# EAGLE design phoneline_fixer (EAGLE 9.6.0)
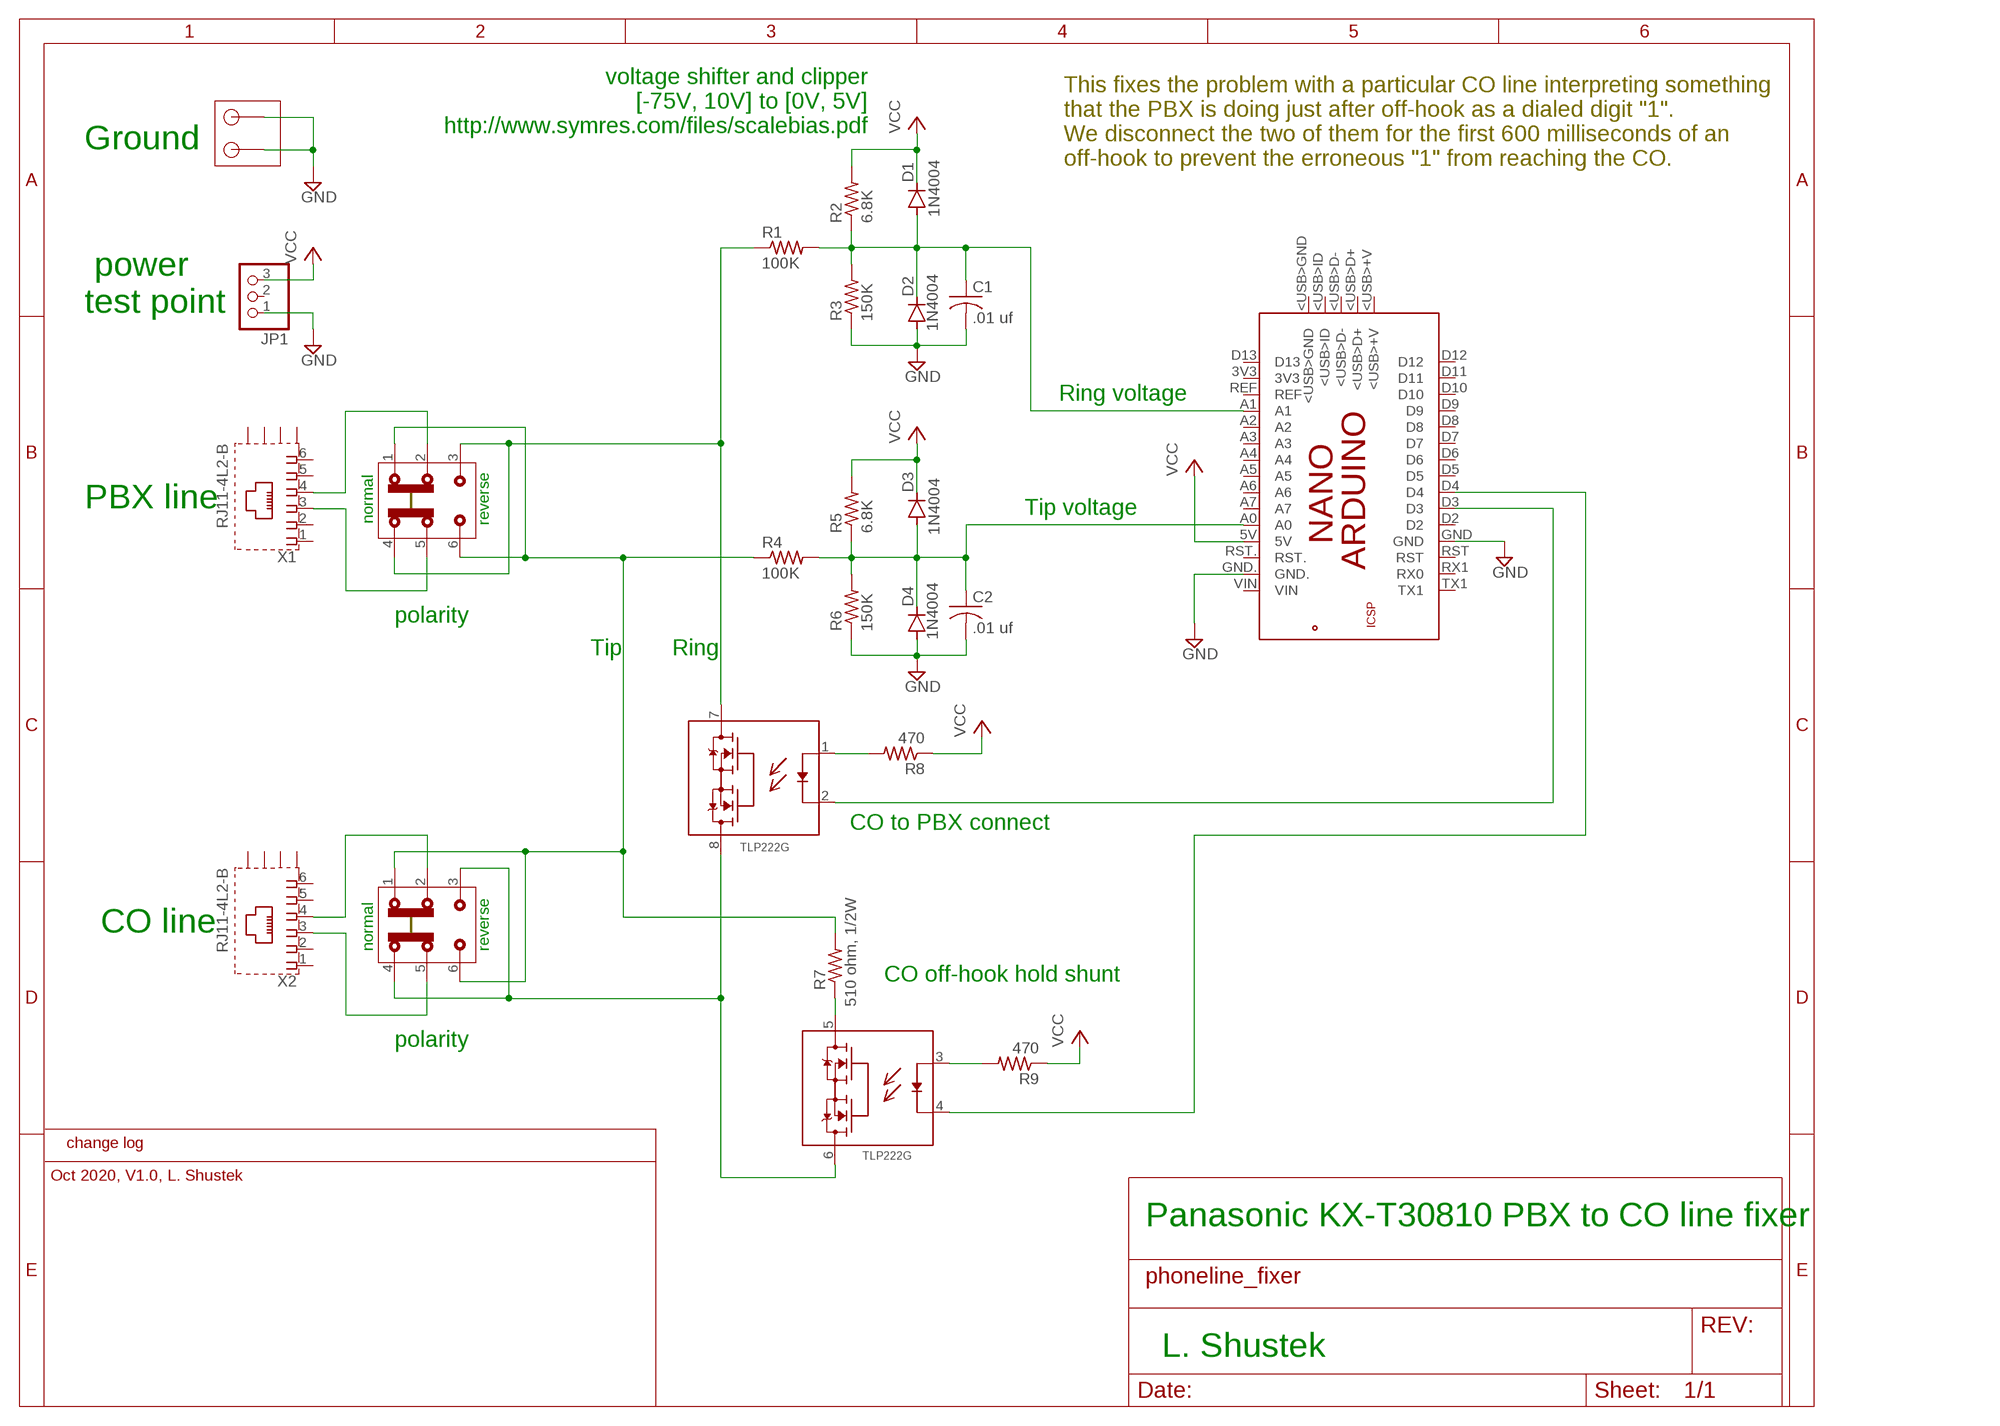
[diagram p0: schematic, sheet 1]

## Parts
C1  .01 uf  C-US050-025X075  [C050-025X075]
C2  .01 uf  C-US050-025X075  [C050-025X075]
D1  1N4004  [DO41-10]
D2  1N4004  [DO41-10]
D3  1N4004  [DO41-10]
D4  1N4004  [DO41-10]
JP1  PINHD-1X3  [1X03]
PCB1  ARDUINO_NANO  [ARDUINO_NANO]
R1  100K  R-US_0207/12  [0207/12]
R2  6.8K  R-US_0207/12  [0207/12]
R3  150K  R-US_0207/12  [0207/12]
R4  100K  R-US_0207/12  [0207/12]
R5  6.8K  R-US_0207/12  [0207/12]
R6  150K  R-US_0207/12  [0207/12]
R7  510 ohm, 1/2W  R-US_0414/15  [0414/15]
R8  470  R-US_0207/12  [0207/12]
R9  470  R-US_0207/12  [0207/12]
U$1  TLP222G  PHOTORELAY  [DIL08]
U$2  CONNECTOR-2PINTHIN  [CONNECTOR-2PIN-5MM_THIN]
U$3  SWITCH_SLIDE_DPDT  [SWITCH_SLIDE_DPDT]
U$4  SWITCH_SLIDE_DPDT  [SWITCH_SLIDE_DPDT]
X1  RJ11-4L2-B  [RJ11-SHIELD2]
X2  RJ11-4L2-B  [RJ11-SHIELD2]

## Nets
GND: C1.2 C2.2 D2.A D4.A JP1.1 PCB1.GND PCB1.GND. R3.1 R6.1 U$2.P$1 U$2.P$2
N$1: C1.1 D1.A D2.C PCB1.A1 R1.2 R2.1 R3.2
N$2: C2.1 D3.A D4.C PCB1.A0 R4.2 R5.1 R6.2
N$4: R7.1 U$1.5(G$1B:D2)
N$6: R8.2 U$1.1(G$1A:A)
N$8: R9.2 U$1.3(G$1B:A)
N$9: U$4.5 X2.3
N$10: U$4.2 X2.4
N$11: PCB1.D3 U$1.2(G$1A:C)
N$12: PCB1.D4 U$1.4(G$1B:C)
N$13: R4.1 R7.2 U$3.1 U$3.6 U$4.1 U$4.6
N$14: U$1.6(G$1B:D1) U$1.8(G$1A:D1) U$4.3 U$4.4
N$15: U$3.5 X1.3
N$16: U$3.2 X1.4
N$18: R1.1 U$1.7(G$1A:D2) U$3.3 U$3.4
VCC: D1.C D3.C JP1.3 PCB1.5V R2.2 R5.2 R8.1 R9.1
Unconnected: JP1.2 PCB1.3V3 PCB1.5V. PCB1.<USB>+V PCB1.<USB>D+ PCB1.<USB>D- PCB1.<USB>GND PCB1.<USB>ID PCB1.A2 PCB1.A3 PCB1.A4 PCB1.A5 PCB1.A6 PCB1.A7 PCB1.D2 PCB1.D5 PCB1.D6 PCB1.D7 PCB1.D8 PCB1.D9 PCB1.D10 PCB1.D11 PCB1.D12 PCB1.D13 PCB1.GND_ PCB1.MISO PCB1.MOSI PCB1.REF PCB1.RESET.. PCB1.RST PCB1.RST. PCB1.RX1(RX0) PCB1.SCK PCB1.TX1 PCB1.VIN X1.1 X1.2 X1.5 X1.6 X1.S1(S) X1.S2(S) X1.S3(S) X1.S4(S) X2.1 X2.2 X2.5 X2.6 X2.S1(S) X2.S2(S) X2.S3(S) X2.S4(S)

## Notes on the sheet
- voltage shifter and clipper
   [-75V, 10V] to [0V, 5V]
  http://www.symres.com/files/scalebias.pdf
- Ground
- This fixes the problem with a particular CO line interpreting something 
  that the PBX is doing just after off-hook as a dialed digit "1". 
  We disconnect the two of them for the first 600 milliseconds of an
  off-hook to prevent the erroneous "1" from reaching the CO.
- power
  test point
- Ring voltage
- PBX line | Tip voltage
- normal | reverse
- polarity
- Tip | Ring
- CO to PBX connect
- CO line
- normal | reverse
- CO off-hook hold shunt
- polarity
- change log
- Oct 2020, V1.0, L. Shustek
- Panasonic KX-T30810 PBX to CO line fixer
- L. Shustek

## Library data of the parts
C1 C2 = resistor:C-US: CAPACITOR, American symbol
D1-D4 = Len:1N4004: DIODE general purpose rectifier, 1 A
JP1 = pinhead:PINHD-1X3: PIN HEADER
PCB1 = Ardunio_E14:ARDUINO_NANO: Device for representing an Arduino Nano board with a footprint in an EAGLE design. Created by Dave Young for Element14. More EAGLE documentation at: http://www.element14.com/community/community/knode/cadsoft_eagle
R1-R9 = resistor:R-US_: RESISTOR, American symbol
U$1 = Len:PHOTORELAY
U$2 = Len:CONNECTOR-2PIN
U$3 U$4 = Len:SWITCH_SLIDE_DPDT: DPDT slide switch
X1 X2 = con-tycoelectronics:RJ11*2: RJ11 (Style 1 Shield / Style 2 Shield) Source: www.tycoelectronics.com .. ENG_DS_1654001_1099_RJ_L_0507.pdf; MF: TYCO ELECTRONICS; MPN: RJ11-4L2-B; OC_FARNELL: unknown; OC_NEWARK: 50F8856

## Net classes
0 default: width 0.635 mm, clearance 0.381 mm

## Board
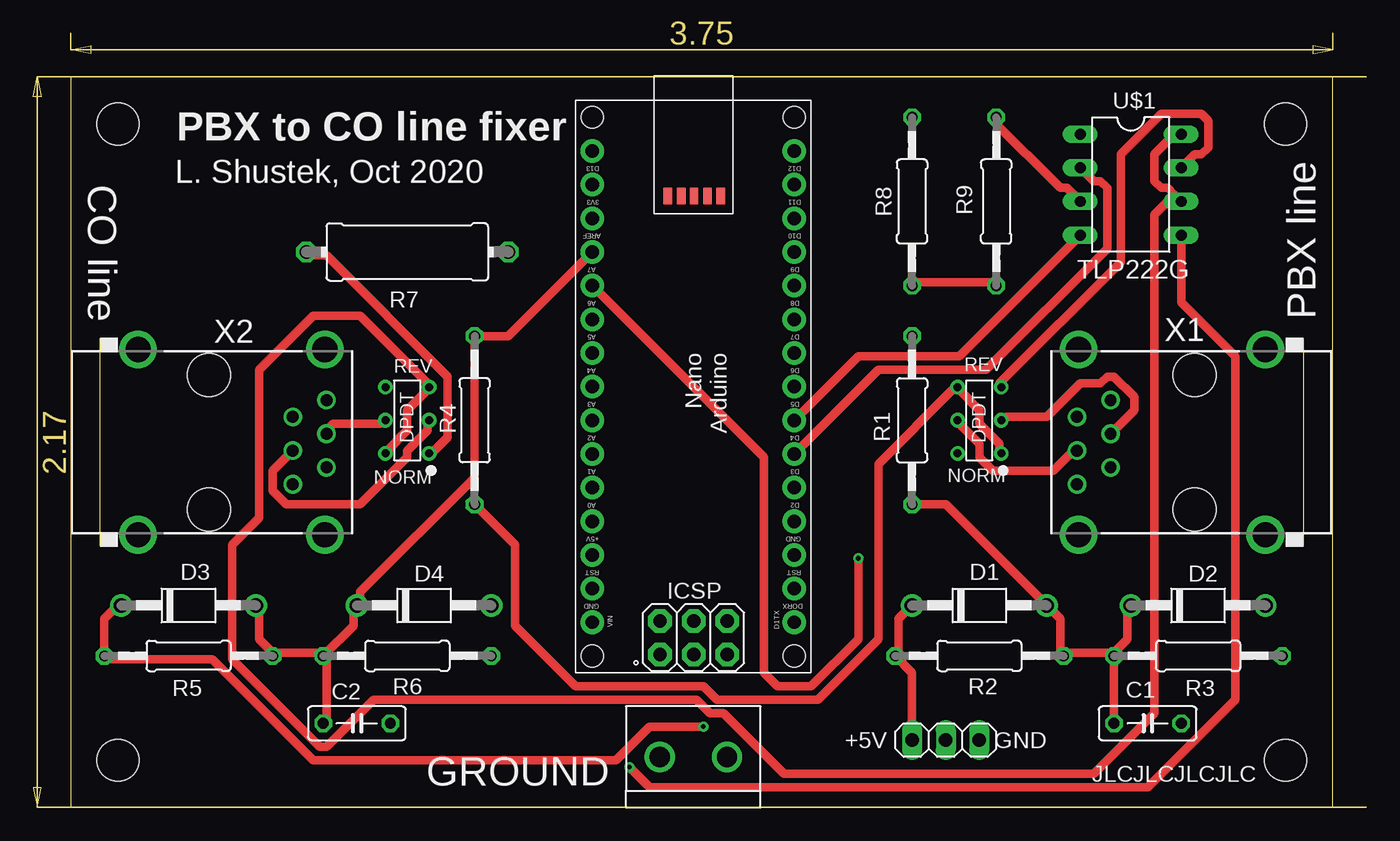
[diagram p1: board, top side]
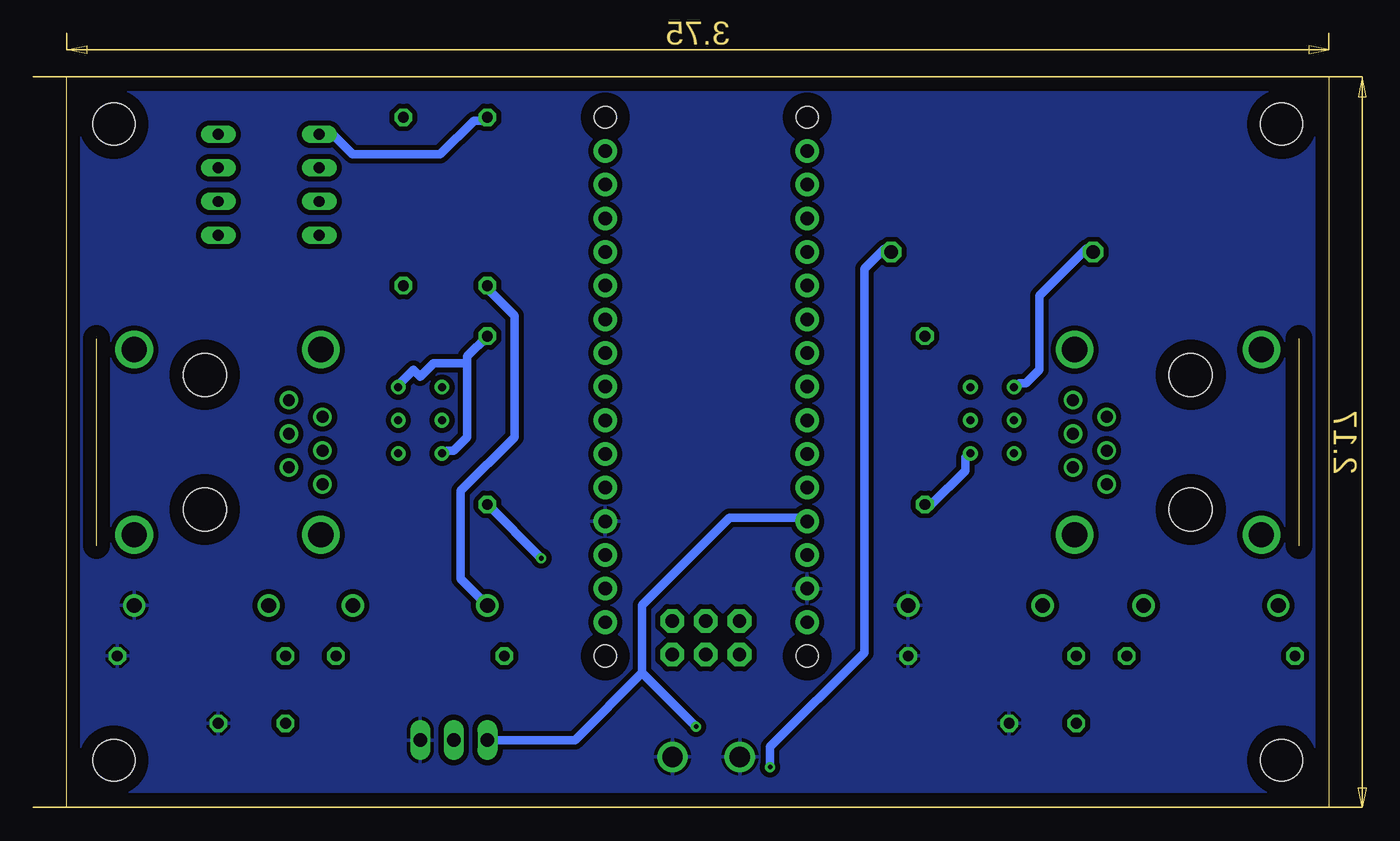
[diagram p2: board, bottom side, seen from below]

Size 95.25 x 55.12 mm. Coordinates in mm from the lower left corner, seen from the top.
Outline: 0,0 95.25,0 95.25,55.12 0,55.12 0,0
Copper layers (1*16): Top 0.035mm / dielectric 1.5mm / Bottom 0.035mm
Design rules "default": minimum track width 6mil, minimum drill 0.35mm, track to track 6mil, track to pad 6mil, pad to pad 6mil, via to via 6mil, smd to smd 6mil, copper to edge 40mil, drill to drill 6mil, minimum pad ring 10mil, minimum via ring 8mil, stop-mask expansion 4mil, vias tented up to drill 0mil, thermal gap 10mil
Holes 3.17 mm at 3.56,3.56 91.69,3.56 91.69,51.56 3.56,51.56

### Footprints (pad centres in the part's own frame; a part is rotated, then mirrored left to right if it is on the bottom)
C050-025X075 = drill 0.813 octagon: 1 -2.54,0; 2 2.54,0
DO41-10 = drill 1.118: A 5.08,0; C -5.08,0
1X03 = drill 1.016 long: 1 -2.54,0; 2 0,0; 3 2.54,0
ARDUINO_NANO = drill 1.016 pad 1.778: 3V3 6.35,1.27; 5V 31.75,1.27; A0 11.43,1.27; A1 13.97,1.27; A2 16.51,1.27; A3 19.05,1.27; A4 21.59,1.27; A5 24.13,1.27; A6 26.67,1.27; A7 29.21,1.27; D2 29.21,16.51; D3 26.67,16.51; D4 24.13,16.51; D5 21.59,16.51; D6 19.05,16.51; D7 16.51,16.51; D8 13.97,16.51; D9 11.43,16.51; D10 8.89,16.51; D11 6.35,16.51; D12 3.81,16.51; D13 3.81,1.27; GND 31.75,16.51; GND. 36.83,1.27; REF 8.89,1.27; RST 34.29,16.51; RST. 34.29,1.27; RX1 36.83,16.51; TX1 39.37,16.51; VIN 39.37,1.27 | drill 1.016 pad 1.778 octagon: 5V. 39.268,6.375; GND_ 39.268,11.455; MISO 41.808,6.375; MOSI 39.268,8.915; RESET.. 41.808,11.455; SCK 41.808,8.915 | smd 1.27 x 0.635: <USB>+V 7.214,10.947; <USB>D+ 7.214,9.957; <USB>D- 7.214,8.941; <USB>GND 7.214,6.96; <USB>ID 7.214,7.976 | hole 1.651: 1.27,1.27; 1.27,16.51; 41.91,16.51; 41.91,1.27
0207/12 = drill 0.813 octagon: 1 -6.35,0; 2 6.35,0
0414/15 = drill 1.016 octagon: 1 -7.62,0; 2 7.62,0
DIL08 = drill 0.813 long: 1 -3.81,-3.81; 2 -1.27,-3.81; 3 1.27,-3.81; 4 3.81,-3.81; 5 3.81,3.81; 6 1.27,3.81; 7 -1.27,3.81; 8 -3.81,3.81
CONNECTOR-2PIN-5MM_THIN = drill 1.524: P$1 0,2.54; P$2 0,-2.54
SWITCH_SLIDE_DPDT = drill 0.6: 1 -2.5,-1.65; 2 0,-1.65; 3 2.5,-1.65; 4 -2.5,1.65; 5 0,1.65; 6 2.5,1.65
RJ11-SHIELD2 = drill 0.9 pad 1.4: 1 -3.175,8.89; 2 -1.905,6.35; 3 -0.635,8.89; 4 0.635,6.35; 5 1.905,8.89; 6 3.175,6.35 | drill 1.9 pad 2.5: S1 -6.985,-5.334; S2 6.985,-5.334; S3 -6.985,8.763; S4 6.985,8.763 | hole 3.251: -5.08,0; 5.08,0

### Placement (x,y rotation side)
C1  81.28,6.35 0 top
C2  21.59,6.35 0 top
D1  68.58,15.24 0 top
D2  85.09,15.24 0 top
D3  8.89,15.24 0 top
D4  26.67,15.24 0 top
JP1  66.04,5.08 180 top
PCB1  38.1,53.34 270 top
R1  63.5,29.21 270 top
R2  68.58,11.43 180 top
R3  85.09,11.43 180 top
R4  30.48,29.21 90 top
R5  8.89,11.43 180 top
R6  25.4,11.43 180 top
R7  25.4,41.91 180 top
R8  63.5,45.72 90 top
R9  69.85,45.72 90 top
U$1  80.01,46.99 270 top
U$2  46.99,3.81 90 top
U$3  68.58,29.21 90 top
U$4  25.4,29.21 90 top
X1  84.84,27.56 90 top
X2  10.41,27.56 270 top

### Tracks (layer width: path | path; a pad name or v marks a point on that pad's centre or on a via)
GND
  pour Bottom: -1.27,55.88 -1.27,-1.27 96.52,-1.27 96.52,55.88
N$1  (via drill 0.35)
  Top 0.635: 78.74,11.68 75.18,11.68 R2.1 74.68,11.68 74.68,14.22 D1.A 66.04,22.86 R1.2 | C1.1 R3.2 78.74,11.68 | 78.74,11.68 79.76,12.7 79.76,15.24 D2.C | PCB1.A1 52.32,26.42 52.32,10.16 53.34,9.14 55.88,9.14 59.44,12.7 v59.44,18.8
  Bottom 0.635: R1.2 v59.44,18.8
N$2
  Top 0.635: PCB1.A0 33.02,35.56 R4.2 30.48,24.89 21.84,16.26 21.84,15.24 D4.C 21.34,15.24 21.34,13.72 R6.2 | 15.24,11.68 18.8,11.68 R6.2 | C2.1 19.3,6.6 19.3,11.18 R6.2 | 15.24,11.68 14.22,12.7 14.22,15.24 D3.A | 15.24,11.68 R5.1
N$4  (via drill 0.35)
  Top 0.635: U$1.5 83.82,38.1 87.88,34.04 87.88,8.13 81.28,1.52 43.69,1.52 v42.16,3.05
  Bottom 0.635: v42.16,3.05 42.16,4.57 35.05,11.68 35.05,40.64 33.53,42.16 33.02,42.16 R7.1
N$6
  Bottom 0.635: U$1.1 75.18,50.8 73.66,49.28 67.06,49.28 64.52,51.82 63.5,51.82 R8.2
N$8
  Top 0.635: U$1.3 75.18,46.74 74.68,46.74 69.6,51.82 R9.2
N$9
  Top 0.635: U$4.5 23.37,28.96 19.81,28.96 19.3,28.45 X2.3
N$10
  Top 0.635: X2.4 15.24,25.4 15.24,23.88 16.26,22.86 21.84,22.86 25.4,26.42 25.4,26.92 26.92,28.45 26.92,28.96 U$4.2
N$11
  Top 0.635: U$1.2 77.22,47.24 77.72,47.24 78.23,46.74 78.23,42.16 69.09,33.02 60.96,33.02 PCB1.D3
N$12
  Top 0.635: U$1.4 67.06,34.04 59.44,34.04 PCB1.D4
N$13
  Top 0.635: U$3.1 70.1,26.92 70.1,27.43 68.58,28.96 68.58,29.97 67.06,31.5 U$3.6 66.55,31.5 60.96,25.91 60.96,12.7 56.39,8.13 48.77,8.13 47.75,9.14 38.1,9.14 33.53,13.72 33.53,19.81 R4.1 | U$4.1 27.43,26.92 28.45,27.94 28.45,32.51 19.3,41.66 17.78,41.66 R7.2
  Bottom 0.635: U$4.6 23.37,32 22.86,32 21.84,33.02 21.84,38.61 18.29,42.16 17.78,42.16 R7.2 | R4.1 29.97,22.86 27.43,25.4 27.43,26.42 U$4.1
N$14
  Top 0.635: 83.31,46.23 82.8,46.74 82.3,46.74 81.79,47.24 81.79,49.28 83.31,50.8 U$1.8 | U$4.4 23.88,26.92 25.4,28.45 25.4,29.97 26.92,31.5 U$4.3 26.92,32 21.84,37.08 18.29,37.08 14.22,33.02 14.22,21.84 12.19,19.81 12.19,11.18 18.8,4.57 19.3,4.57 22.86,8.13 47.24,8.13 48.26,7.11 49.28,7.11 53.85,2.54 77.22,2.54 81.79,7.11 81.79,44.7 83.31,46.23 | 83.31,46.23 U$1.6
N$15
  Top 0.635: U$3.5 67.06,28.96 68.58,27.43 68.58,26.42 69.6,25.4 74.17,25.4 75.69,26.92 X1.3
N$16
  Top 0.635: X1.4 80.26,29.97 80.26,30.99 78.74,32.51 78.23,32.51 77.72,32 76.2,32 73.66,29.46 70.61,29.46 U$3.2
N$18
  Top 0.635: U$1.7 84.84,49.28 85.34,49.28 85.85,49.78 85.85,51.82 85.34,52.32 82.3,52.32 79.25,49.28 79.25,41.15 70.1,32 U$3.3
  Bottom 0.635: 65.02,33.53 65.02,34.04 R1.1 | 65.02,33.53 65.02,27.94 66.04,26.92 66.55,26.92 U$3.4 | 65.02,33.53 67.56,33.53 68.58,32.51 69.09,33.02 70.1,32 U$3.3
VCC  (via drill 0.35)
  Top 0.635: R8.1 63.5,39.62 69.6,39.62 R9.1 | D3.C 3.56,15.24 2.54,14.22 R5.2 2.54,11.18 10.67,11.18 18.29,3.56 41.15,3.56 43.69,6.1 v47.75,6.1 | D1.C 62.48,14.22 62.48,11.68 R2.2 63.5,10.16 JP1.3
  Bottom 0.635: 51.82,10.16 51.82,15.24 45.21,21.84 39.62,21.84 PCB1.5V | 51.82,10.16 56.9,5.08 JP1.3 | 51.82,10.16 v47.75,6.1 | D1.C 63.5,15.75 64.01,15.75 65.53,17.27 65.53,23.88 61.47,27.94 61.47,37.08 63.5,39.12 R8.1

### Text on the board
tPlace: PBX to CO line fixer | CO line | L. Shustek, Oct 2020 | TLP222G | PBX line | REV | REV | NORM | NORM | +5V | GND | GROUND | JLCJLCJLCJLC